# Altium schematic sheet OSU_Robotics_Kids_lights.SchDoc
size A
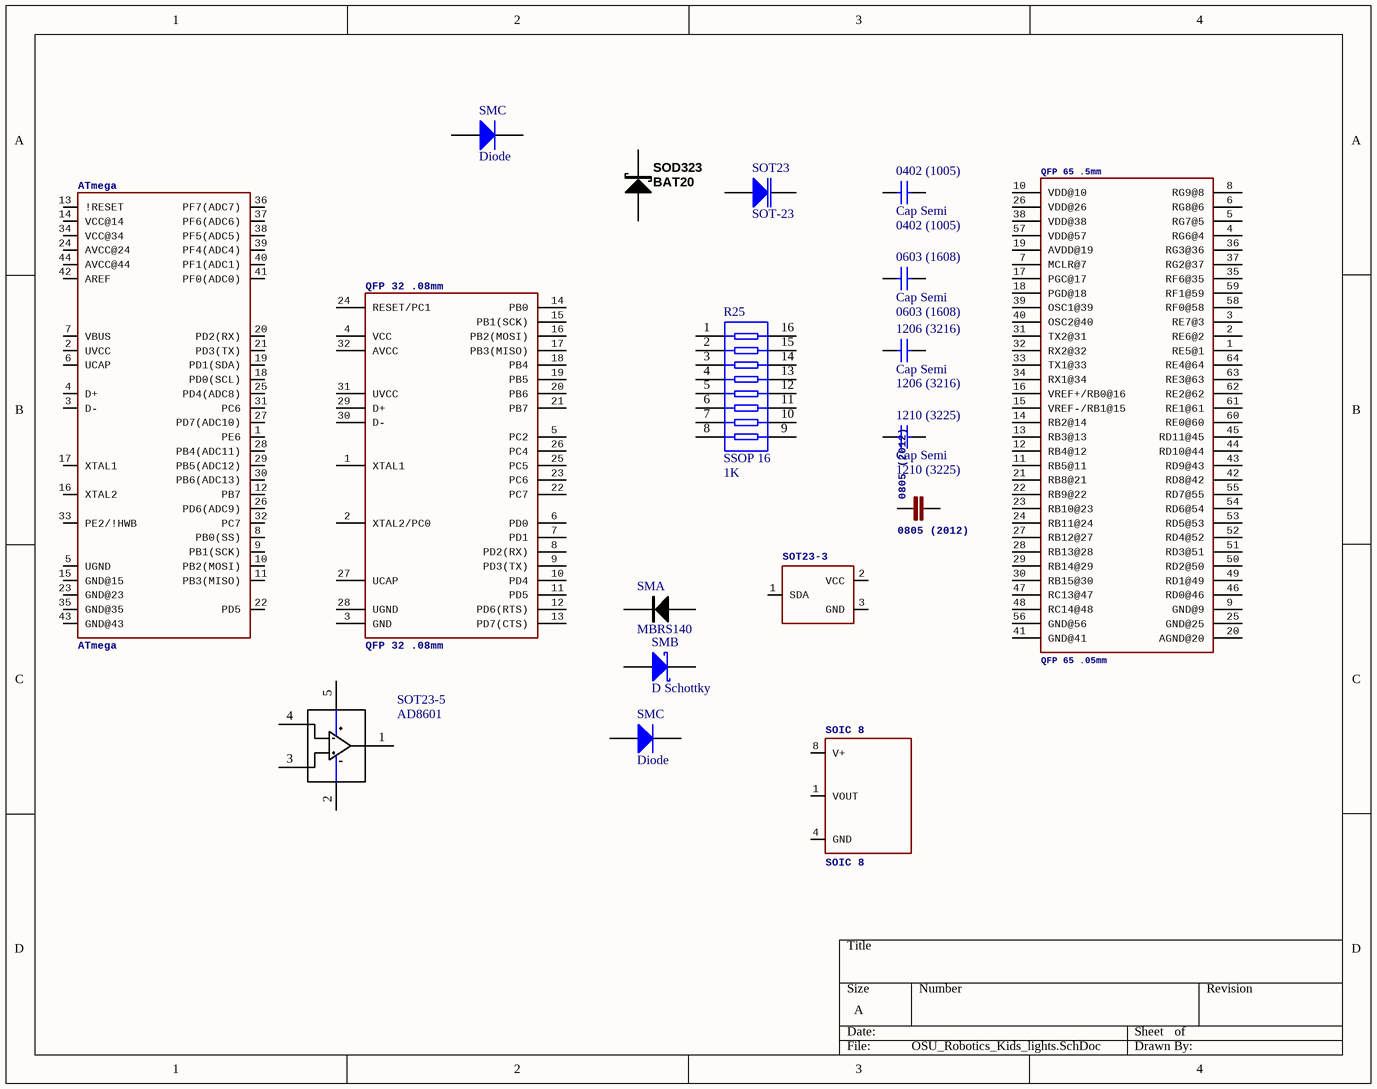
[diagram p0: OSU_Robotics_Kids_lights.SchDoc]

## Parts
(Parts that share a designator on the sheet are numbered #1, #2 ... from top to bottom, then left to right.)
0402_(1005)  Cap Semi  value 0402 (1005)  [0402]
0603_(1608)  Cap Semi  value 0603 (1608)  [1608[0603]]
0805_(2012)  0805 (2012)  [0805]
1206_(3216)  Cap Semi  value 1206 (3216)  [C1206]
1210_(3225)  Cap Semi  value 1210 (3225)  [C1210]
ATmega  ATmega  [SPARKFUN-DIGITALIC_TQFP44]
QFP_32_.08mm  QFP 32 .08mm  [TQFP32-08_MCU]
QFP_65_.5mm  QFP 65 .05mm  [TQFP64_MCU]
R25  SSOP 16  value 1K  [SSOP16_N]
SMA  MBRS140  [DIODE-SMA]
SMB  D Schottky  [SMB]
SMC#1  Diode  [SMC]
SMC#2  Diode  [SMC]
SOD323  BAT20  [SOD323]
SOIC_8  SOIC 8  [SOIC-8]
SOT23  SOT-23  [SOT23_N]
SOT23-3  (no value)  [SOT23-3]
SOT23-5  AD8601  [SOT23-5]

## Nets

Not connected (* = marked no-connect by the designer): 0402_(1005) 1 2; 0603_(1608) 1 2; 0805_(2012) 1 2; 1206_(3216) 1 2; 1210_(3225) 1 2; ATmega 1(PE6) 2(UVCC) 3(D-) 4(D+) 5(UGND) 6(UCAP) 7(VBUS) 8(PB0(SS)) 9(PB1(SCK)) 10(PB2(MOSI)) 11(PB3(MISO)) 12(PB7) 13(!RESET) 14(VCC@14) 15(GND@15) 16(XTAL2) 17(XTAL1) 18(PD0(SCL)) 19(PD1(SDA)) 20(PD2(RX)) 21(PD3(TX)) 22(PD5) 23(GND@23) 24(AVCC@24) 25(PD4(ADC8)) 26(PD6(ADC9)) 27(PD7(ADC10)) 28(PB4(ADC11)) 29(PB5(ADC12)) 30(PB6(ADC13)) 31(PC6) 32(PC7) 33(PE2/!HWB) 34(VCC@34) 35(GND@35) 36(PF7(ADC7)) 37(PF6(ADC6)) 38(PF5(ADC5)) 39(PF4(ADC4)) 40(PF1(ADC1)) 41(PF0(ADC0)) 42(AREF) 43(GND@43) 44(AVCC@44); QFP_32_.08mm 1(XTAL1) 2(XTAL2/PC0) 3(GND) 4(VCC) 5(PC2) 6(PD0) 7(PD1) 8(PD2(RX)) 9(PD3(TX)) 10(PD4) 11(PD5) 12(PD6(RTS)) 13(PD7(CTS)) 14(PB0) 15(PB1(SCK)) 16(PB2(MOSI)) 17(PB3(MISO)) 18(PB4) 19(PB5) 20(PB6) 21(PB7) 22(PC7) 23(PC6) 24(RESET/PC1) 25(PC5) 26(PC4) 27(UCAP) 28(UGND) 29(D+) 30(D-) 31(UVCC) 32(AVCC); QFP_65_.5mm 1(RE5@1) 2(RE6@2) 3(RE7@3) 4(RG6@4) 5(RG7@5) 6(RG8@6) 7(MCLR@7) 8(RG9@8) 9(GND@9) 10(VDD@10) 11(RB5@11) 12(RB4@12) 13(RB3@13) 14(RB2@14) 15(VREF-/RB1@15) 16(VREF+/RB0@16) 17(PGC@17) 18(PGD@18) 19(AVDD@19) 20(AGND@20) 21(RB8@21) 22(RB9@22) 23(RB10@23) 24(RB11@24) 25(GND@25) 26(VDD@26) 27(RB12@27) 28(RB13@28) 29(RB14@29) 30(RB15@30) 31(TX2@31) 32(RX2@32) 33(TX1@33) 34(RX1@34) 35(RF6@35) 36(RG3@36) 37(RG2@37) 38(VDD@38) 39(OSC1@39) 40(OSC2@40) 41(GND@41) 42(RD8@42) 43(RD9@43) 44(RD10@44) 45(RD11@45) 46(RD0@46) 47(RC13@47) 48(RC14@48) 49(RD1@49) 50(RD2@50) 51(RD3@51) 52(RD4@52) 53(RD5@53) 54(RD6@54) 55(RD7@55) 56(GND@56) 57(VDD@57) 58(RF0@58) 59(RF1@59) 60(RE0@60) 61(RE1@61) 62(RE2@62) 63(RE3@63) 64(RE4@64); R25 1 2 3 4 5 6 7 8 9 10 11 12 13 14 15 16; SMA A K; SMB 1(A) 2(K); SMC#1 1(A) 2(K); SMC#2 1(A) 2(K); SOD323 A K; SOIC_8 1(VOUT) 4(GND) 8(V+); SOT23 1(K) 3(A); SOT23-3 1(SDA) 2(VCC) 3(GND); SOT23-5 1 2 3 4 5

## Library data of the parts
0402_(1005) 0603_(1608) 1206_(3216) 1210_(3225) = Cap Semi: Capacitor (Semiconductor SIM Model); Published: 8-Jun-2000; LatestRevisionDate: 29-May-2009; LatestRevisionNote: IPC-7351 Footprint Added.; PackageReference: C1206; Publisher: Altium Limited; PackageDescription: Chip Capacitor
0805_(2012) = 10UF-0805-10V-10%: PROD_ID: CAP-11330
ATmega = ATMEGA32U4TQFP: PROD_ID: IC-11161
QFP_32_.08mm = ATMEGA8U2AU: PROD_ID: IC-10104
QFP_65_.5mm = DSPIC30F6015SMD
R25 = Res Pack4: Isolated Resistor Network; Published: 24-Mar-1999; LatestRevisionDate: 29-May-2009; LatestRevisionNote: IPC-7351 Footprint Added.; PackageVersion: Oct-2003; PackageReference: SSOP16; Publisher: Altium Limited; PackageDescription: 16-Pin Plastic Small Outline Package 0.65 mm Pitch; Code_JEDEC: MO-150-AC; Code_IPC: SOP65P780-16
SMA = MBRS140: DIODE; Supplier 1: Digi-Key; Supplier Part Number 1: MBRS140FSTR-ND
SMB = D Schottky: Schottky Diode; Published: 8-Jun-2000; LatestRevisionDate: 17-Jul-2002; LatestRevisionNote: Re-released for DXP Platform.; PackageReference: SMB; Publisher: Altium Limited; PackageDescription: DO-214-AA/SMB; 2 C-Bend Leads; Body 5.3 x 3.6 mm, inc. leads (LxW); Code_JEDEC: DO-214-AA
SMC#1 SMC#2 = Diode: Default Diode; Published: 8-Jun-2000; LatestRevisionDate: 17-Jul-2002; LatestRevisionNote: Re-released for DXP Platform.; PackageVersion: Sep-1996; PackageReference: SMC; Publisher: Altium Limited; PackageDescription: DO-214-AB/SMC; 2 C-Bend Leads; Body 7.9 x 5.9 mm, inc. leads (LxW); Code_JEDEC: DO-214-AB
SOD323 = BAT20-SOD323: Schottky Diode SOD323 1A 23V; Supplier 1: Digi-Key; Supplier Part Number 1: 497-3381-2-ND
SOIC_8 = LM34DM: PROD_ID: IC-08232
SOT23 = Diode BBY31: SOT23 Silicon Planar Variable Capacitance Diode; Note: Pin 2 is not connected and not drawn.; Published: 8-Jun-2000; LatestRevisionDate: 29-May-2009; LatestRevisionNote: IPC-7351 Footprint Added.; DatasheetVersion: Jan-1998; PackageVersion: 1996; PackageReference: SOT23; Publisher: Altium Limited; PackageDescription: 3-Pin SOT-23 Package 0.95 mm Pitch, 2.3 mm Lead Span - Reverse Pinning; ComponentLink1Description: Manufacturer Link; ComponentLink1URL: http://www.zetex.com/; ComponentLink2Description: Datasheet; ComponentLink2URL: www.zetex.com/3.0/pdf/BBY31.pdf
SOT23-3 = ATSHA204-TSU: PROD_ID: IC-11208
SOT23-5 = AD8601: RAIL TO RAIL OPAMP; Manufacturer: Analog Devices Inc; Manufacturer Part Number: AD8601WDRTZ-REEL7; Text Field1: ST; Text Field2: LM2903DT; Text Field3: Avnet; Text Field5: SO8; Text Field6: 0.078; Voltage - Input Offset: 1300µV; Current - Supply: 750µA; Number of Circuits: 1; Slew Rate: 6 V/µs; Voltage - Supply, Single/Dual (±): 2.7 V ~ 5.5 V; Current - Input Bias: 0.2pA; Amplifier Type: General Purpose; Output Type: Rail-to-Rail; Current - Output / Channel: 50mA; Gain Bandwidth Product: 8.4MHz; Text Field4: LM2903DT; NI?: *; O?: *; Section:: *; Supplier 1: Digi-Key; Supplier Part Number 1: AD8601WDRTZ-REEL7CT-ND; RoHS: RoHS Compliant; Category: Integrated Circuits (ICs); Supplier Part Number: AD8601WDRTZ-REEL7CT-ND; Operating Temperature: -40°C ~ 125°C; Packaging: Cut Tape (CT); Supplier: Digi-Key; Package / Case: SOT-23-5, SC-74A, SOT-25